# Altium schematic sheet Hat_Top_Level.SchDoc
size A3; Address1: ECE Department; Address2: University of Canterbury; Address3: Christchurch 8041; Address4: New Zealand; Revision: 1
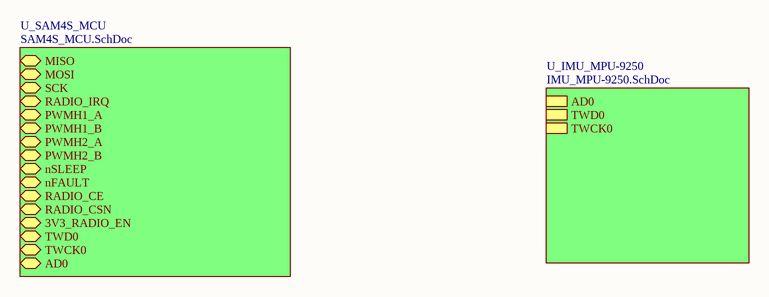
[diagram p0: Hat_Top_Level.SchDoc]

## Sub-sheets
U_IMU_MPU-9250 = IMU_MPU-9250.SchDoc: AD0, TWD0, TWCK0
U_SAM4S_MCU = SAM4S_MCU.SchDoc: MISO (bidir), MOSI (bidir), SCK (bidir), RADIO_IRQ (bidir), PWMH1_A (bidir), PWMH1_B (bidir), PWMH2_A (bidir), PWMH2_B (bidir), nSLEEP (bidir), nFAULT (bidir), RADIO_CE (bidir), RADIO_CSN (bidir), 3V3_RADIO_EN (bidir), TWD0 (bidir), TWCK0 (bidir), AD0 (bidir)

## Notes on the sheet
- Title
- Drawn by:
- Date:
- Time:
- Revision:
- Sheet
- of
- File: